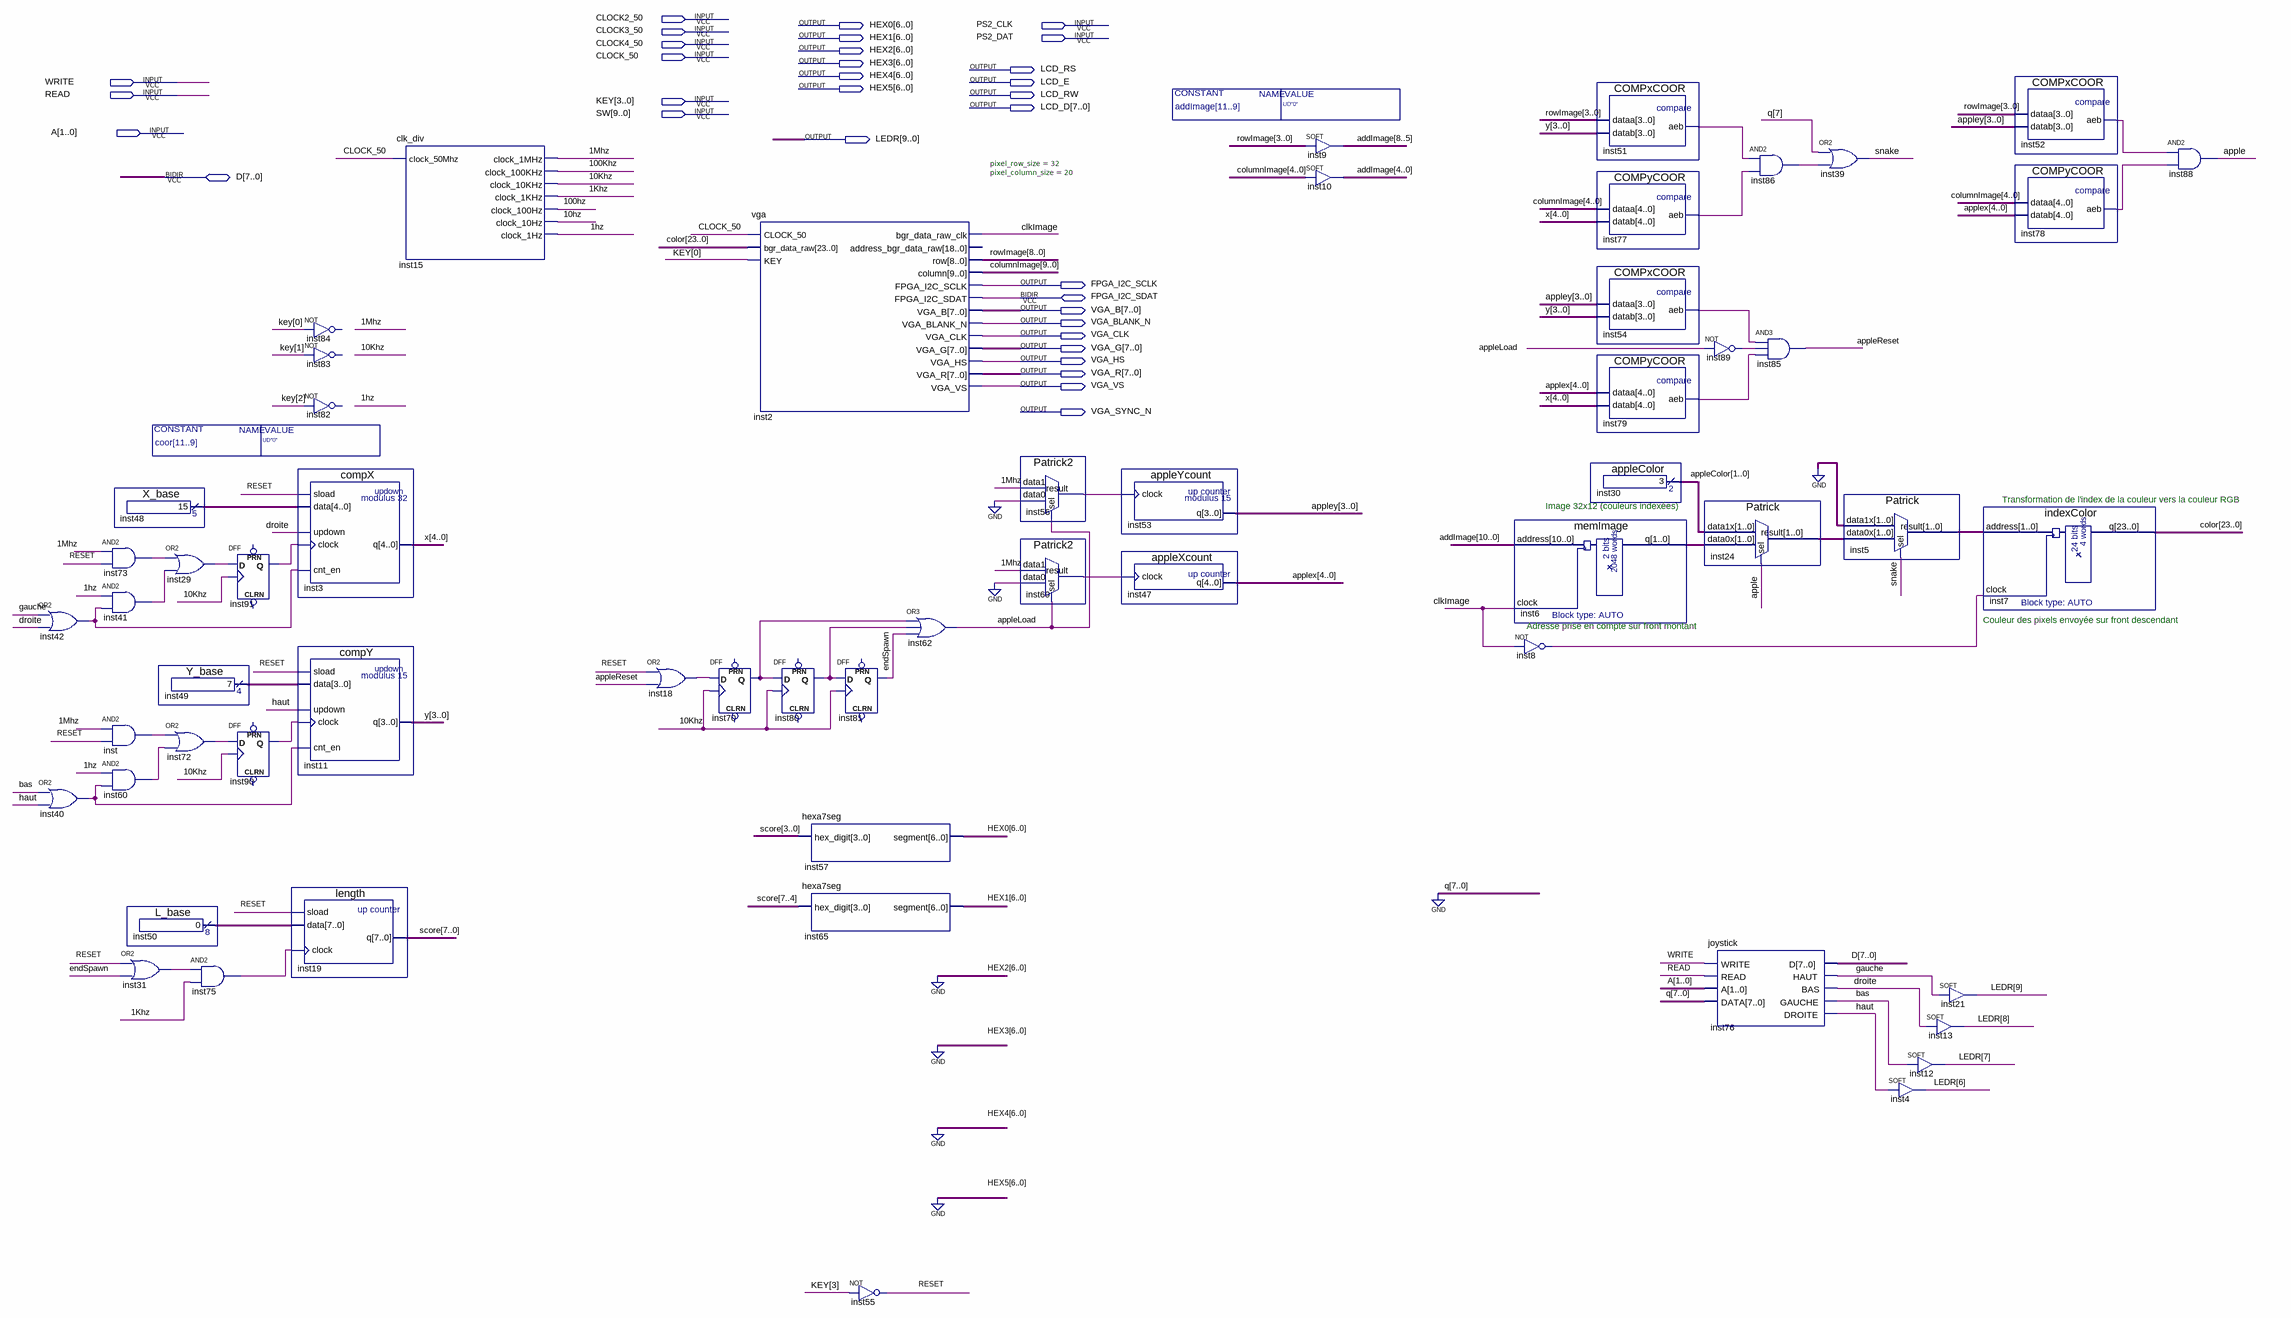
[diagram p0: schematic sheet]
// Quartus schematic Main.bdf as structural Verilog: 59 symbols, 33 pins
module Main #(parameter \addImage[11..9]  = "UD\"0\"", parameter \coor[11..9]  = "UD\"0\"") (
  input  CLOCK2_50,
  input  PS2_CLK,
  input  CLOCK3_50,
  input  PS2_DAT,
  input  CLOCK4_50,
  input  CLOCK_50,
  input  WRITE,
  input  READ,
  input  [3:0] KEY,
  input  [9:0] SW,
  input  [1:0] A,
  inout  [7:0] D,
  inout  FPGA_I2C_SDAT,
  output [6:0] HEX0,
  output [6:0] HEX1,
  output [6:0] HEX2,
  output [6:0] HEX3,
  output LCD_RS,
  output [6:0] HEX4,
  output LCD_E,
  output [6:0] HEX5,
  output LCD_RW,
  output [7:0] LCD_D,
  output [9:0] LEDR,
  output FPGA_I2C_SCLK,
  output [7:0] VGA_B,
  output VGA_BLANK_N,
  output VGA_CLK,
  output [7:0] VGA_G,
  output VGA_HS,
  output [7:0] VGA_R,
  output VGA_VS,
  output VGA_SYNC_N
);

  wire \1hz , \1Khz , \1Mhz , \10hz , \10Khz , \100hz , \100Khz , apple, appleLoad, appleReset, bas,
       clkImage, droite, endSpawn, gauche, haut, inst8_out, inst18_out, inst29_out, inst31_out, inst40_out,
       inst41_out, inst42_out, inst51_aeb, inst52_aeb, inst54_aeb, inst56_result, inst60_out, inst69_result,
       inst70_q, inst72_out, inst73_out, inst75_out, inst77_aeb, inst78_aeb, inst79_aeb, inst80_q,
       inst86_out, inst89_out, inst90_q, inst91_q, inst_out, RESET, snake;
  wire [1:0] appleColor, inst5_result, inst6_q, inst24_result;
  wire [3:0] appley, inst49_result, y;
  wire [4:0] applex, inst48_result, x;
  wire [7:0] inst50_result, score;
  wire [8:0] rowImage;
  wire [9:0] columnImage;
  wire [10:0] addImage;
  wire [23:0] color;

  or inst42 (inst42_out, gauche, droite);
  or inst40 (inst40_out, bas, haut);
  X_base inst48 (.result(inst48_result));
  and inst73 (inst73_out, \1Mhz , RESET);
  and inst41 (inst41_out, \1hz , inst42_out);
  and inst (inst_out, \1Mhz , RESET);
  and inst60 (inst60_out, \1hz , inst40_out);
  L_base inst50 (.result(inst50_result));
  or inst31 (inst31_out, RESET, endSpawn);
  or inst29 (inst29_out, inst73_out, inst41_out);
  Y_base inst49 (.result(inst49_result));
  or inst72 (inst72_out, inst_out, inst60_out);
  DFF inst91 (.CLK(\10Khz ), .D(inst29_out), .Q(inst91_q));  // open: CLRN, PRN
  DFF inst90 (.CLK(\10Khz ), .D(inst72_out), .Q(inst90_q));  // open: CLRN, PRN
  and inst75 (inst75_out, inst31_out, \1Khz );
  // NOT inst84 has open pins: IN=KEY[0], OUT=open
  // NOT inst83 has open pins: IN=KEY[1], OUT=open
  // NOT inst82 has open pins: IN=KEY[2], OUT=open
  compX inst3 (.sload(RESET), .data(inst48_result), .updown(droite), .clock(inst91_q), .cnt_en(inst42_out), .q(x));
  compY inst11 (.sload(RESET), .data(inst49_result), .updown(haut), .clock(inst90_q), .cnt_en(inst40_out), .q(y));
  length inst19 (.sload(RESET), .data(inst50_result), .clock(inst75_out), .q(score));
  clk_div inst15 (
    .clock_50Mhz(CLOCK_50), .clock_1MHz(\1Mhz ), .clock_100KHz(\100Khz ), .clock_10KHz(\10Khz ),
    .clock_1KHz(\1Khz ), .clock_100Hz(\100hz ), .clock_10Hz(\10hz ), .clock_1Hz(\1hz ));
  or inst18 (inst18_out, RESET, appleReset);
  DFF inst70 (.CLK(\10Khz ), .D(inst18_out), .Q(inst70_q));  // open: CLRN, PRN
  vga #(.pixel_row_size(32), .pixel_column_size(20)) inst2 (
    .CLOCK_50(CLOCK_50), .bgr_data_raw(color), .KEY(KEY[0]), .bgr_data_raw_clk(clkImage), .row(rowImage),
    .column(columnImage), .FPGA_I2C_SCLK(FPGA_I2C_SCLK), .VGA_B(VGA_B), .VGA_BLANK_N(VGA_BLANK_N),
    .VGA_CLK(VGA_CLK), .VGA_G(VGA_G), .VGA_HS(VGA_HS), .VGA_R(VGA_R), .VGA_VS(VGA_VS),
    .FPGA_I2C_SDAT(FPGA_I2C_SDAT));  // open: address_bgr_data_raw
  DFF inst80 (.CLK(\10Khz ), .D(inst70_q), .Q(inst80_q));  // open: CLRN, PRN
  DFF inst81 (.CLK(\10Khz ), .D(inst80_q), .Q(endSpawn));  // open: CLRN, PRN
  hexa7seg inst57 (.hex_digit(score[3:0]), .segment(HEX0));
  hexa7seg inst65 (.hex_digit(score[7:4]), .segment(HEX1));
  not inst55 (RESET, KEY[3]);
  or inst62 (appleLoad, inst70_q, inst80_q, endSpawn);
  Patrick2 inst56 (.data1(\1Mhz ), .data0(1'b0), .sel(appleLoad), .result(inst56_result));
  Patrick2 inst69 (.data1(\1Mhz ), .data0(1'b0), .sel(appleLoad), .result(inst69_result));
  appleYcount inst53 (.clock(inst56_result), .q(appley));
  appleXcount inst47 (.clock(inst69_result), .q(applex));
  SOFT inst9[3:0] (.IN(rowImage[3:0]), .OUT(addImage[8:5]));
  SOFT inst10[4:0] (.IN(columnImage[4:0]), .OUT(addImage[4:0]));
  memImage inst6 (.address(addImage), .clock(clkImage), .q(inst6_q));
  not inst8 (inst8_out, clkImage);
  COMPxCOOR inst51 (.dataa(rowImage[3:0]), .datab(y), .aeb(inst51_aeb));
  COMPyCOOR inst77 (.dataa(columnImage[4:0]), .datab(x), .aeb(inst77_aeb));
  COMPxCOOR inst54 (.dataa(appley), .datab(y), .aeb(inst54_aeb));
  COMPyCOOR inst79 (.dataa(applex), .datab(x), .aeb(inst79_aeb));
  appleColor inst30 (.result(appleColor));
  not inst89 (inst89_out, appleLoad);
  Patrick inst24 (.data1x(appleColor), .data0x(inst6_q), .sel(apple), .result(inst24_result));
  joystick inst76 (
    .WRITE(WRITE), .READ(READ), .A(A), .DATA({8{1'b0}}), .HAUT(gauche), .BAS(droite), .GAUCHE(bas),
    .DROITE(haut), .D(D));
  and inst86 (inst86_out, inst51_aeb, inst77_aeb);
  and inst85 (appleReset, inst54_aeb, inst89_out, inst79_aeb);
  or inst39 (snake, 1'b0, inst86_out);
  Patrick inst5 (.data1x(2'b00), .data0x(inst24_result), .sel(snake), .result(inst5_result));
  SOFT inst12 (.IN(bas), .OUT(LEDR[7]));
  SOFT inst4 (.IN(haut), .OUT(LEDR[6]));
  SOFT inst21 (.IN(gauche), .OUT(LEDR[9]));
  SOFT inst13 (.IN(droite), .OUT(LEDR[8]));
  indexColor inst7 (.address(inst5_result), .clock(inst8_out), .q(color));
  COMPxCOOR inst52 (.dataa(rowImage[3:0]), .datab(appley), .aeb(inst52_aeb));
  COMPyCOOR inst78 (.dataa(columnImage[4:0]), .datab(applex), .aeb(inst78_aeb));
  and inst88 (apple, inst52_aeb, inst78_aeb);

  assign HEX2 = {7{1'b0}};
  assign HEX3 = {7{1'b0}};
  assign HEX4 = {7{1'b0}};
  assign HEX5 = {7{1'b0}};

  // Notes on the sheet:
  //   Transformation de l'index de la couleur vers la couleur RGB
  //   Image 32x12 (couleurs indexées)
  //   Couleur des pixels envoyée sur front descendant
  //   Adresse prise en compte sur front montant
endmodule
